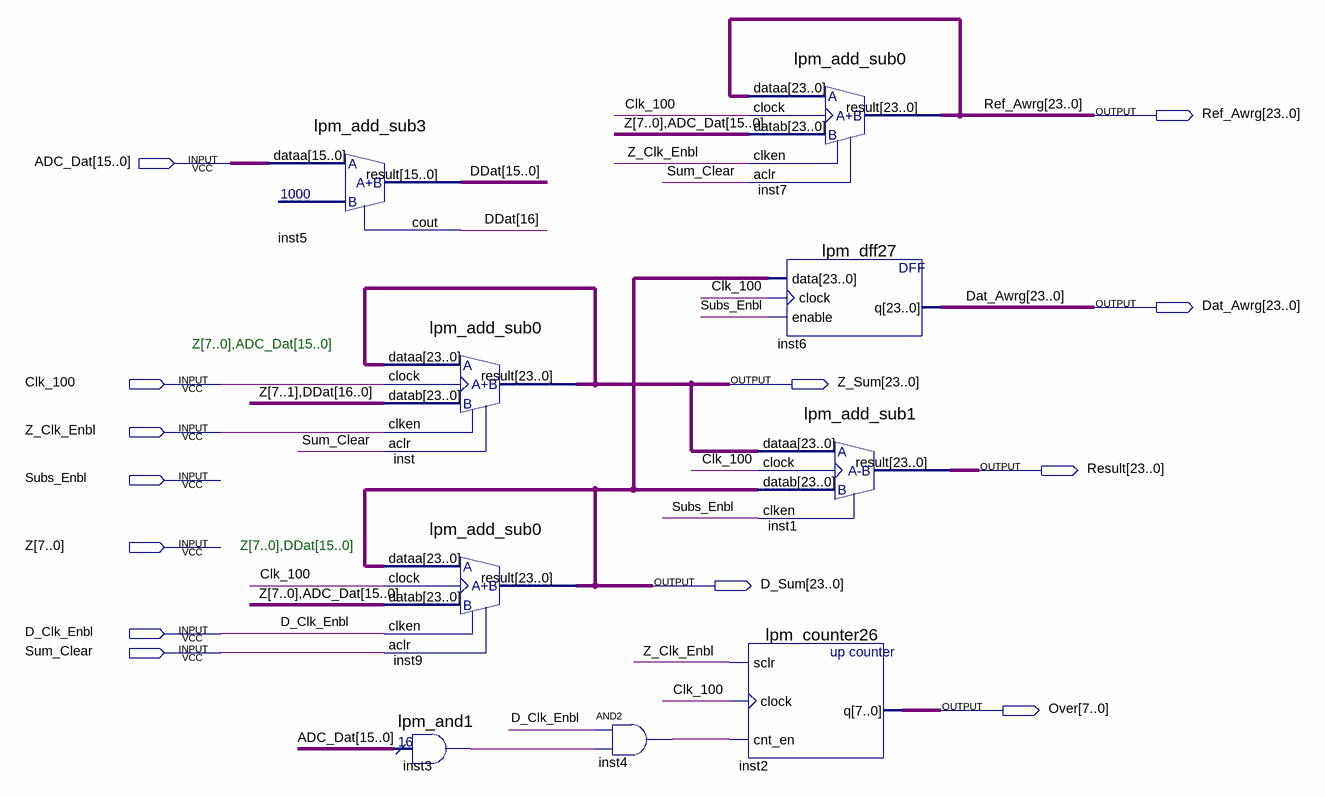
[diagram p0: schematic sheet]
// Quartus schematic Filter_DCDS_Module.bdf as structural Verilog: 9 symbols, 13 pins
module Filter_DCDS_Module (
  input  [15:0] ADC_Dat,
  input  Clk_100,
  input  Z_Clk_Enbl,
  input  Subs_Enbl,
  input  [7:0] Z,
  input  D_Clk_Enbl,
  input  Sum_Clear,
  output [23:0] Ref_Awrg,
  output [23:0] Dat_Awrg,
  output [23:0] Z_Sum,
  output [23:0] Result,
  output [23:0] D_Sum,
  output [7:0] Over
);

  wire inst3_result, inst4_out;
  wire [16:0] DDat;

  lpm_add_sub3 inst5 (.dataa(ADC_Dat), .result(DDat[15:0]), .cout(DDat[16]));
  lpm_add_sub0 inst (
    .dataa(Z_Sum), .datab({Z[7:1], DDat}), .clock(Clk_100), .clken(Z_Clk_Enbl), .aclr(Sum_Clear),
    .result(Z_Sum));
  lpm_add_sub0 inst9 (
    .dataa(D_Sum), .datab({Z, ADC_Dat}), .clock(Clk_100), .clken(D_Clk_Enbl), .aclr(Sum_Clear), .result(D_Sum));
  lpm_and1 inst3 (.data(ADC_Dat), .result(inst3_result));
  and inst4 (inst4_out, D_Clk_Enbl, inst3_result);
  lpm_counter26 inst2 (.sclr(Z_Clk_Enbl), .clock(Clk_100), .cnt_en(inst4_out), .q(Over));
  lpm_add_sub0 inst7 (
    .dataa(Ref_Awrg), .datab({Z, ADC_Dat}), .clock(Clk_100), .clken(Z_Clk_Enbl), .aclr(Sum_Clear),
    .result(Ref_Awrg));
  lpm_dff27 inst6 (.data(D_Sum), .clock(Clk_100), .enable(Subs_Enbl), .q(Dat_Awrg));
  lpm_add_sub1 inst1 (.dataa(Z_Sum), .datab(D_Sum), .clock(Clk_100), .clken(Subs_Enbl), .result(Result));

  // Notes on the sheet:
  //   Z[7..0],ADC_Dat[15..0]
  //   Z[7..0],DDat[15..0]
endmodule
